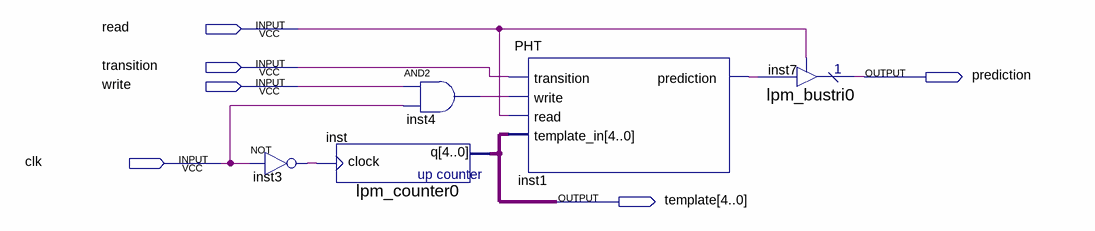
[diagram p0: schematic sheet]
// Quartus schematic Lab7.bdf as structural Verilog: 5 symbols, 6 pins
module Lab7 (
  input  read,
  input  transition,
  input  write,
  input  clk,
  output prediction,
  output [4:0] template
);

  wire inst1_prediction, inst3_out, inst4_out;

  not inst3 (inst3_out, clk);
  lpm_counter0 inst (.clock(inst3_out), .q(template));
  and inst4 (inst4_out, write, clk);
  PHT inst1 (
    .transition(transition), .write(inst4_out), .read(read), .template_in(template),
    .prediction(inst1_prediction));
  lpm_bustri0 inst7 (.enabledt(read), .data(inst1_prediction), .tridata(prediction));
endmodule
